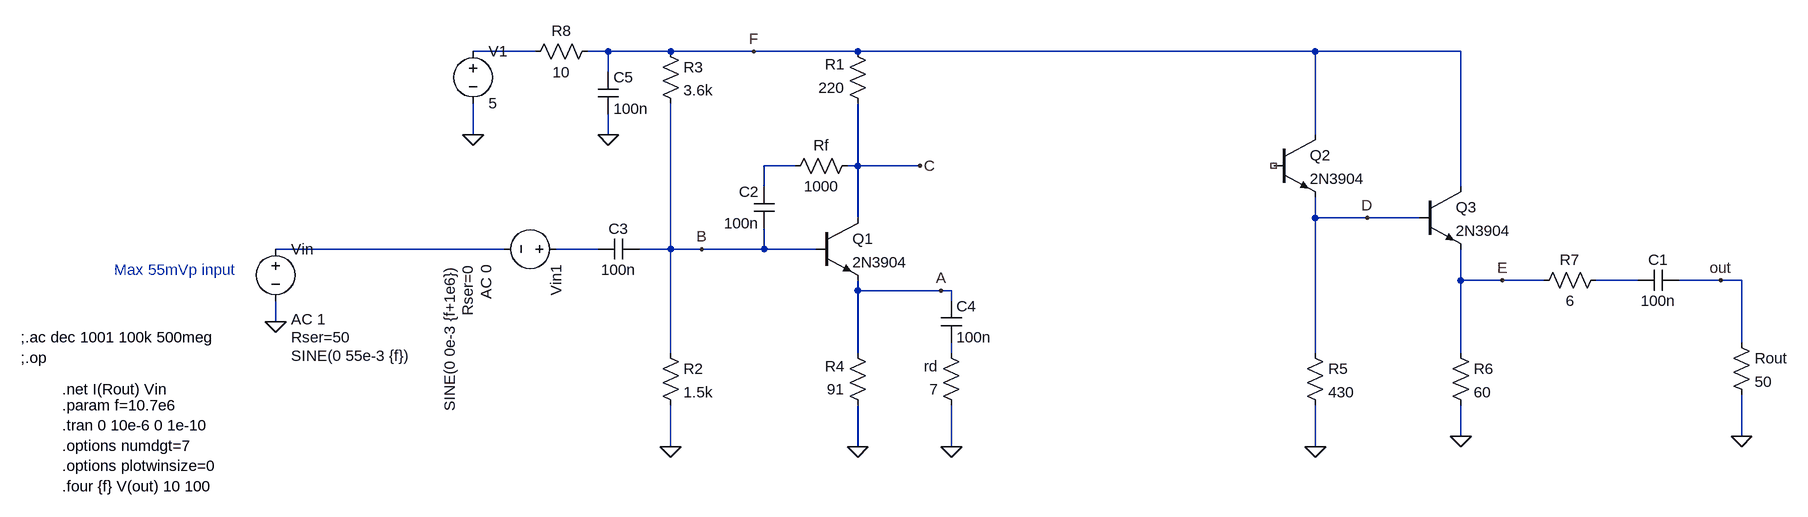
[diagram p0: schematic TIA3_5V_RL470.asc]
TIA3_5V_RL470.asc, the LTspice schematic file:
Version 4
SHEET 1 1584 680
WIRE -352 -112 -448 -112
WIRE -240 -112 -272 -112
WIRE -144 -112 -240 -112
WIRE -16 -112 -144 -112
WIRE 144 -112 -16 -112
WIRE 848 -112 144 -112
WIRE 1072 -112 848 -112
WIRE -240 -80 -240 -112
WIRE -448 16 -448 -32
WIRE -240 16 -240 -16
WIRE 848 16 848 -112
WIRE 48 64 0 64
WIRE 144 64 144 -32
WIRE 144 64 128 64
WIRE 240 64 144 64
WIRE 0 96 0 64
WIRE 1072 96 1072 -112
WIRE 144 144 144 64
WIRE 848 144 848 112
WIRE 928 144 848 144
WIRE 1008 144 928 144
WIRE -400 192 -752 192
WIRE -256 192 -320 192
WIRE -144 192 -144 -32
WIRE -144 192 -192 192
WIRE -96 192 -144 192
WIRE 0 192 0 160
WIRE 0 192 -96 192
WIRE 80 192 0 192
WIRE 1072 240 1072 192
WIRE 1136 240 1072 240
WIRE 1200 240 1136 240
WIRE 1344 240 1280 240
WIRE 1472 240 1408 240
WIRE 1504 240 1472 240
WIRE 144 256 144 240
WIRE 272 256 144 256
WIRE 288 256 272 256
WIRE 288 272 288 256
WIRE -752 304 -752 272
WIRE 1504 336 1504 240
WIRE -144 352 -144 192
WIRE 144 352 144 256
WIRE 288 352 288 336
WIRE 848 352 848 144
WIRE 1072 352 1072 240
WIRE 1072 480 1072 432
WIRE 1504 480 1504 416
WIRE -144 496 -144 432
WIRE 144 496 144 432
WIRE 288 496 288 432
WIRE 848 496 848 432
FLAG -144 496 0
FLAG 144 496 0
FLAG 288 496 0
FLAG 848 496 0
FLAG 1072 480 0
FLAG 1504 480 0
FLAG -448 16 0
FLAG -752 304 0
FLAG -240 16 0
FLAG 272 256 A
FLAG -96 192 B
FLAG 240 64 C
FLAG 928 144 D
FLAG 1136 240 E
FLAG -16 -112 F
FLAG 1472 240 out
SYMBOL npn 80 144 R0
SYMATTR InstName Q1
SYMATTR Value 2N3904
SYMBOL res -160 -128 R0
SYMATTR InstName R3
SYMATTR Value 3.6k
SYMBOL res -160 336 R0
SYMATTR InstName R2
SYMATTR Value 1.5k
SYMBOL res 144 48 R90
WINDOW 0 0 56 VBottom 2
WINDOW 3 32 56 VTop 2
SYMATTR InstName Rf
SYMATTR Value 1000
SYMBOL res 160 -16 R180
WINDOW 0 36 76 Left 2
WINDOW 3 36 40 Left 2
SYMATTR InstName R1
SYMATTR Value 220
SYMBOL res 160 448 R180
WINDOW 0 36 76 Left 2
WINDOW 3 36 40 Left 2
SYMATTR InstName R4
SYMATTR Value 91
SYMBOL res 304 448 R180
WINDOW 0 36 76 Left 2
WINDOW 3 36 40 Left 2
SYMATTR InstName rd
SYMATTR Value 7
SYMBOL npn 784 16 R0
SYMATTR InstName Q2
SYMATTR Value 2N3904
SYMBOL npn 1008 96 R0
SYMATTR InstName Q3
SYMATTR Value 2N3904
SYMBOL res 832 336 R0
SYMATTR InstName R5
SYMATTR Value 430
SYMBOL res 1056 336 R0
SYMATTR InstName R6
SYMATTR Value 60
SYMBOL res 1296 224 R90
WINDOW 0 0 56 VBottom 2
WINDOW 3 32 56 VTop 2
SYMATTR InstName R7
SYMATTR Value 6
SYMBOL cap 1408 224 R90
WINDOW 0 0 32 VBottom 2
WINDOW 3 32 32 VTop 2
SYMATTR InstName C1
SYMATTR Value 100n
SYMBOL cap 16 160 R180
WINDOW 0 24 56 Left 2
WINDOW 3 24 8 Left 2
SYMATTR InstName C2
SYMATTR Value 100n
SYMBOL cap -256 208 R270
WINDOW 0 32 32 VTop 2
WINDOW 3 0 32 VBottom 2
SYMATTR InstName C3
SYMATTR Value 100n
SYMBOL res 1488 320 R0
SYMATTR InstName Rout
SYMATTR Value 50
SYMBOL voltage -448 -128 R0
WINDOW 123 0 0 Left 0
WINDOW 39 0 0 Left 0
SYMATTR InstName V1
SYMATTR Value 5
SYMBOL voltage -752 176 R0
WINDOW 3 24 180 Left 2
WINDOW 123 24 124 Left 2
WINDOW 39 24 152 Left 2
SYMATTR Value SINE(0 55e-3 {f})
SYMATTR Value2 AC 1
SYMATTR SpiceLine Rser=50
SYMATTR InstName Vin
SYMBOL cap 272 272 R0
SYMATTR InstName C4
SYMATTR Value 100n
SYMBOL res -256 -128 R90
WINDOW 0 0 56 VBottom 2
WINDOW 3 32 56 VTop 2
SYMATTR InstName R8
SYMATTR Value 10
SYMBOL cap -256 -80 R0
SYMATTR InstName C5
SYMATTR Value 100n
SYMBOL voltage -304 192 R90
WINDOW 3 24 180 Left 2
WINDOW 123 24 124 Left 2
WINDOW 39 24 152 Left 2
SYMATTR Value SINE(0 0e-3 {f+1e6})
SYMATTR Value2 AC 0
SYMATTR SpiceLine Rser=0
SYMATTR InstName Vin1
TEXT -1080 408 Left 2 !.net I(Rout) Vin
TEXT -1144 328 Left 2 !;.ac dec 1001 100k 500meg\n;.op
TEXT -1080 432 Left 2 !.param f=10.7e6\n.tran 0 10e-6 0 1e-10\n.options numdgt=7\n.options plotwinsize=0\n.four {f} V(out) 10 100
TEXT -1000 224 Left 2 ;Max 55mVp input

The netlist it stands for:
* TIA3_5V_RL470.asc
Q1 C B A 0 2N3904
R3 F B 3.6k
R2 B 0 1.5k
Rf C N002 1000
R1 C F 220
R4 0 A 91
rd 0 N006 7
Q2 F NC_01 D 0 2N3904
Q3 F D E 0 2N3904
R5 D 0 430
R6 E 0 60
R7 N005 E 6
C1 out N005 100n
C2 B N002 100n
C3 N004 B 100n
Rout out 0 50
V1 N001 0 5
Vin N003 0 SINE(0 55e-3 {f}) AC 1 Rser=50
C4 A N006 100n
R8 F N001 10
C5 F 0 100n
Vin1 N004 N003 SINE(0 0e-3 {f+1e6}) AC 0 Rser=0
.model NPN NPN
.model PNP PNP
.lib standard.bjt
.net I(Rout) Vin
;.ac dec 1001 100k 500meg
;.op
.param f=10.7e6
.tran 0 10e-6 0 1e-10
.options numdgt=7
.options plotwinsize=0
.four {f} V(out) 10 100
* Max 55mVp input
.backanno
.end